# Altium schematic sheet 3 - Motor Drivers.SchDoc
size Tabloid
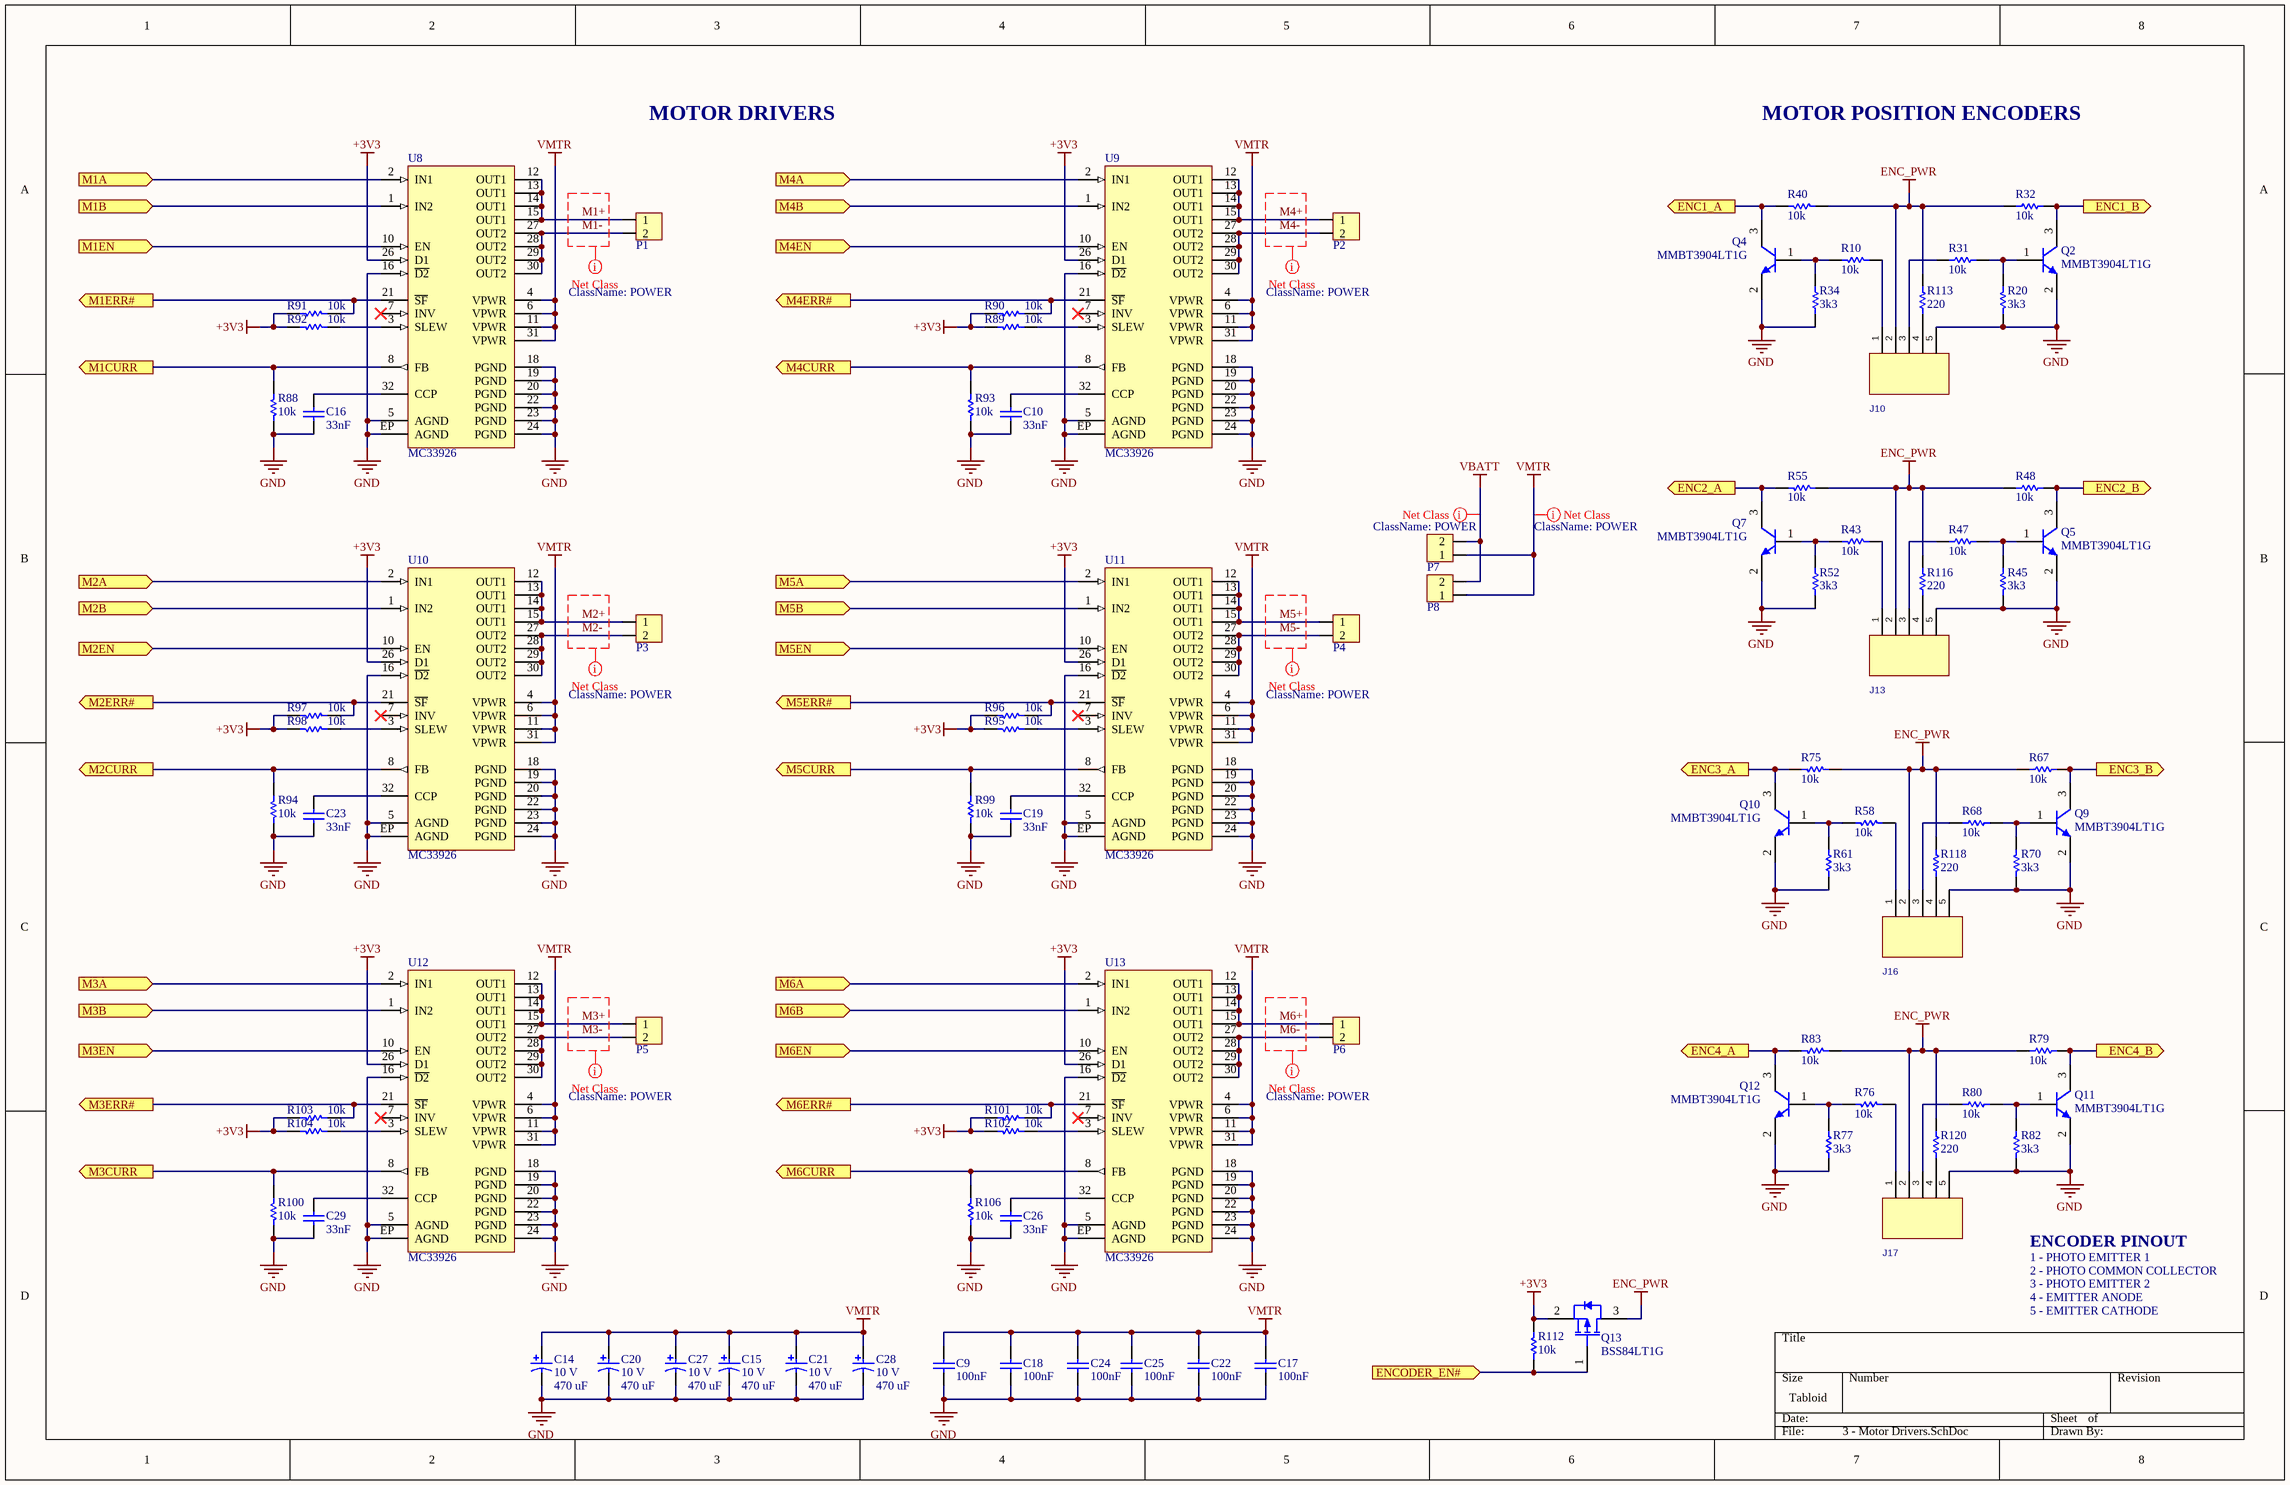
[diagram p0: 3 - Motor Drivers.SchDoc]

## Parts
C9  value 100nF  [CAPC0805(2012)100_L]  (hidden comment: CAP 100nF 6.3V 0805(2012))
C10  value 33nF  [CAPC0805(2012)100_L]  (hidden comment: CAP 33nF 50V 0805(2012))
C14  Rated Voltage: 10 V  Rated Capacitance: 470 uF  [NIC-CAPA2-8X10_V]  (hidden comment: UUD1A471MNL1GS)
C15  Rated Voltage: 10 V  Rated Capacitance: 470 uF  [NIC-CAPA2-8X10_V]  (hidden comment: UUD1A471MNL1GS)
C16  value 33nF  [CAPC0805(2012)100_L]  (hidden comment: CAP 33nF 50V 0805(2012))
C17  value 100nF  [CAPC0805(2012)100_L]  (hidden comment: CAP 100nF 6.3V 0805(2012))
C18  value 100nF  [CAPC0805(2012)100_L]  (hidden comment: CAP 100nF 6.3V 0805(2012))
C19  value 33nF  [CAPC0805(2012)100_L]  (hidden comment: CAP 33nF 50V 0805(2012))
C20  Rated Voltage: 10 V  Rated Capacitance: 470 uF  [NIC-CAPA2-8X10_V]  (hidden comment: UUD1A471MNL1GS)
C21  Rated Voltage: 10 V  Rated Capacitance: 470 uF  [NIC-CAPA2-8X10_V]  (hidden comment: UUD1A471MNL1GS)
C22  value 100nF  [CAPC0805(2012)100_L]  (hidden comment: CAP 100nF 6.3V 0805(2012))
C23  value 33nF  [CAPC0805(2012)100_L]  (hidden comment: CAP 33nF 50V 0805(2012))
C24  value 100nF  [CAPC0805(2012)100_L]  (hidden comment: CAP 100nF 6.3V 0805(2012))
C25  value 100nF  [CAPC0805(2012)100_L]  (hidden comment: CAP 100nF 6.3V 0805(2012))
C26  value 33nF  [CAPC0805(2012)100_L]  (hidden comment: CAP 33nF 50V 0805(2012))
C27  Rated Voltage: 10 V  Rated Capacitance: 470 uF  [NIC-CAPA2-8X10_V]  (hidden comment: UUD1A471MNL1GS)
C28  Rated Voltage: 10 V  Rated Capacitance: 470 uF  [NIC-CAPA2-8X10_V]  (hidden comment: UUD1A471MNL1GS)
C29  value 33nF  [CAPC0805(2012)100_L]  (hidden comment: CAP 33nF 50V 0805(2012))
J10  DF13-5P-1.25DS(20)  [HRS_DF13-5P-1.25DS(20)]  (value not drawn)
J13  DF13-5P-1.25DS(20)  [HRS_DF13-5P-1.25DS(20)]  (value not drawn)
J16  DF13-5P-1.25DS(20)  [HRS_DF13-5P-1.25DS(20)]  (value not drawn)
J17  DF13-5P-1.25DS(20)  [HRS_DF13-5P-1.25DS(20)]  (value not drawn)
P1  HDR1x2_2.54  [HDR1X2_2.54_180]  (value not drawn)
P2  HDR1x2_2.54  [HDR1X2_2.54_180]  (value not drawn)
P3  HDR1x2_2.54  [HDR1X2_2.54_180]  (value not drawn)
P4  HDR1x2_2.54  [HDR1X2_2.54_180]  (value not drawn)
P5  HDR1x2_2.54  [HDR1X2_2.54_180]  (value not drawn)
P6  HDR1x2_2.54  [HDR1X2_2.54_180]  (value not drawn)
P7  HDR1x2_2.54  [HDR1X2_2.54_180]  (value not drawn)
P8  HDR1x2_2.54  [HDR1X2_2.54_180]  (value not drawn)
Q2  MMBT3904LT1G  [ONSC-SOT-23-3-318-08_V]
Q4  MMBT3904LT1G  [ONSC-SOT-23-3-318-08_V]
Q5  MMBT3904LT1G  [ONSC-SOT-23-3-318-08_V]
Q7  MMBT3904LT1G  [ONSC-SOT-23-3-318-08_V]
Q9  MMBT3904LT1G  [ONSC-SOT-23-3-318-08_V]
Q10  MMBT3904LT1G  [ONSC-SOT-23-3-318-08_V]
Q11  MMBT3904LT1G  [ONSC-SOT-23-3-318-08_V]
Q12  MMBT3904LT1G  [ONSC-SOT-23-3-318-08_V]
Q13  BSS84LT1G  [ONSC-SOT-23-3-318-08_V]
R10  value 10k  [RESC0805(2012)_L]  (hidden comment: 10K 1% 0805(2012))
R20  value 3k3  [RESC0805(2012)_L]  (hidden comment: 3K3 1% 0805(2012))
R31  value 10k  [RESC0805(2012)_L]  (hidden comment: 10K 1% 0805(2012))
R32  value 10k  [RESC0805(2012)_L]  (hidden comment: 10K 1% 0805(2012))
R34  value 3k3  [RESC0805(2012)_L]  (hidden comment: 3K3 1% 0805(2012))
R40  value 10k  [RESC0805(2012)_L]  (hidden comment: 10K 1% 0805(2012))
R43  value 10k  [RESC0805(2012)_L]  (hidden comment: 10K 1% 0805(2012))
R45  value 3k3  [RESC0805(2012)_L]  (hidden comment: 3K3 1% 0805(2012))
R47  value 10k  [RESC0805(2012)_L]  (hidden comment: 10K 1% 0805(2012))
R48  value 10k  [RESC0805(2012)_L]  (hidden comment: 10K 1% 0805(2012))
R52  value 3k3  [RESC0805(2012)_L]  (hidden comment: 3K3 1% 0805(2012))
R55  value 10k  [RESC0805(2012)_L]  (hidden comment: 10K 1% 0805(2012))
R58  value 10k  [RESC0805(2012)_L]  (hidden comment: 10K 1% 0805(2012))
R61  value 3k3  [RESC0805(2012)_L]  (hidden comment: 3K3 1% 0805(2012))
R67  value 10k  [RESC0805(2012)_L]  (hidden comment: 10K 1% 0805(2012))
R68  value 10k  [RESC0805(2012)_L]  (hidden comment: 10K 1% 0805(2012))
R70  value 3k3  [RESC0805(2012)_L]  (hidden comment: 3K3 1% 0805(2012))
R75  value 10k  [RESC0805(2012)_L]  (hidden comment: 10K 1% 0805(2012))
R76  value 10k  [RESC0805(2012)_L]  (hidden comment: 10K 1% 0805(2012))
R77  value 3k3  [RESC0805(2012)_L]  (hidden comment: 3K3 1% 0805(2012))
R79  value 10k  [RESC0805(2012)_L]  (hidden comment: 10K 1% 0805(2012))
R80  value 10k  [RESC0805(2012)_L]  (hidden comment: 10K 1% 0805(2012))
R82  value 3k3  [RESC0805(2012)_L]  (hidden comment: 3K3 1% 0805(2012))
R83  value 10k  [RESC0805(2012)_L]  (hidden comment: 10K 1% 0805(2012))
R88  value 10k  [RESC0805(2012)_L]  (hidden comment: 10K 1% 0805(2012))
R89  value 10k  [RESC0805(2012)_L]  (hidden comment: 10K 1% 0805(2012))
R90  value 10k  [RESC0805(2012)_L]  (hidden comment: 10K 1% 0805(2012))
R91  value 10k  [RESC0805(2012)_L]  (hidden comment: 10K 1% 0805(2012))
R92  value 10k  [RESC0805(2012)_L]  (hidden comment: 10K 1% 0805(2012))
R93  value 10k  [RESC0805(2012)_L]  (hidden comment: 10K 1% 0805(2012))
R94  value 10k  [RESC0805(2012)_L]  (hidden comment: 10K 1% 0805(2012))
R95  value 10k  [RESC0805(2012)_L]  (hidden comment: 10K 1% 0805(2012))
R96  value 10k  [RESC0805(2012)_L]  (hidden comment: 10K 1% 0805(2012))
R97  value 10k  [RESC0805(2012)_L]  (hidden comment: 10K 1% 0805(2012))
R98  value 10k  [RESC0805(2012)_L]  (hidden comment: 10K 1% 0805(2012))
R99  value 10k  [RESC0805(2012)_L]  (hidden comment: 10K 1% 0805(2012))
R100  value 10k  [RESC0805(2012)_L]  (hidden comment: 10K 1% 0805(2012))
R101  value 10k  [RESC0805(2012)_L]  (hidden comment: 10K 1% 0805(2012))
R102  value 10k  [RESC0805(2012)_L]  (hidden comment: 10K 1% 0805(2012))
R103  value 10k  [RESC0805(2012)_L]  (hidden comment: 10K 1% 0805(2012))
R104  value 10k  [RESC0805(2012)_L]  (hidden comment: 10K 1% 0805(2012))
R106  value 10k  [RESC0805(2012)_L]  (hidden comment: 10K 1% 0805(2012))
R112  value 10k  [RESC0805(2012)_L]  (hidden comment: 10K 1% 0805(2012))
R113  value 220  [RESC0805(2012)_L]  (hidden comment: 220R 1% 0805(2012))
R116  value 220  [RESC0805(2012)_L]  (hidden comment: 220R 1% 0805(2012))
R118  value 220  [RESC0805(2012)_L]  (hidden comment: 220R 1% 0805(2012))
R120  value 220  [RESC0805(2012)_L]  (hidden comment: 220R 1% 0805(2012))
U8  MC33926  [FREESCALE_32PQFN]
U9  MC33926  [FREESCALE_32PQFN]
U10  MC33926  [FREESCALE_32PQFN]
U11  MC33926  [FREESCALE_32PQFN]
U12  MC33926  [FREESCALE_32PQFN]
U13  MC33926  [FREESCALE_32PQFN]

## Ports
ENC1_A (out), ENC1_B (out), ENC2_A (out), ENC2_B (out), ENC3_A (out), ENC3_B (out), ENC4_A (out), ENC4_B (out), ENCODER_EN# (in), M1A (in), M1B (in), M1CURR (out), M1EN (in), M1ERR# (out), M2A (in), M2B (in), M2CURR (out), M2EN (in), M2ERR# (out), M3A (in), M3B (in), M3CURR (out), M3EN (in), M3ERR# (out), M4A (in), M4B (in), M4CURR (out), M4EN (in), M4ERR# (out), M5A (in), M5B (in), M5CURR (out), M5EN (in), M5ERR# (out), M6A (in), M6B (in), M6CURR (out), M6EN (in), M6ERR# (out)

## Nets
+3V3: Q13.2(S) R89.2 R90.2 R91.2 R92.2 R95.2 R96.2 R97.2 R98.2 R101.2 R102.2 R103.2 R104.2 R112.1 U8.26(D1) U9.26(D1) U10.26(D1) U11.26(D1) U12.26(D1) U13.26(D1)
ENC_PWR: J10.2 J13.2 J16.2 J17.2 Q13.3(D) R32.1 R40.2 R48.1 R55.2 R67.1 R75.2 R79.1 R83.2 R113.2 R116.2 R118.2 R120.2
GND: C9.1 C10.1 C14.2 C15.2 C16.1 C17.1 C18.1 C19.1 C20.2 C21.2 C22.1 C23.1 C24.1 C25.1 C26.1 C27.2 C28.2 C29.1 J10.5 J13.5 J16.5 J17.5 Q2.2(E) Q4.2(E) Q5.2(E) Q7.2(E) Q9.2(E) Q10.2(E) Q11.2(E) Q12.2(E) R20.2 R34.2 R45.2 R52.2 R61.2 R70.2 R77.2 R82.2 R88.1 R93.1 R94.1 R99.1 R100.1 R106.1 U8.5(AGND) U8.16(~{D2}) U8.18(PGND) U8.19(PGND) U8.20(PGND) U8.22(PGND) U8.23(PGND) U8.24(PGND) U8.EP(AGND) U9.5(AGND) U9.16(~{D2}) U9.18(PGND) U9.19(PGND) U9.20(PGND) U9.22(PGND) U9.23(PGND) U9.24(PGND) U9.EP(AGND) U10.5(AGND) U10.16(~{D2}) U10.18(PGND) U10.19(PGND) U10.20(PGND) U10.22(PGND) U10.23(PGND) U10.24(PGND) U10.EP(AGND) U11.5(AGND) U11.16(~{D2}) U11.18(PGND) U11.19(PGND) U11.20(PGND) U11.22(PGND) U11.23(PGND) U11.24(PGND) U11.EP(AGND) U12.5(AGND) U12.16(~{D2}) U12.18(PGND) U12.19(PGND) U12.20(PGND) U12.22(PGND) U12.23(PGND) U12.24(PGND) U12.EP(AGND) U13.5(AGND) U13.16(~{D2}) U13.18(PGND) U13.19(PGND) U13.20(PGND) U13.22(PGND) U13.23(PGND) U13.24(PGND) U13.EP(AGND)
VBATT: P7.2 P8.2
VMTR: C9.2 C14.1 C15.1 C17.2 C18.2 C20.1 C21.1 C22.2 C24.2 C25.2 C27.1 C28.1 P7.1 P8.1 U8.4(VPWR) U8.6(VPWR) U8.11(VPWR) U8.31(VPWR) U9.4(VPWR) U9.6(VPWR) U9.11(VPWR) U9.31(VPWR) U10.4(VPWR) U10.6(VPWR) U10.11(VPWR) U10.31(VPWR) U11.4(VPWR) U11.6(VPWR) U11.11(VPWR) U11.31(VPWR) U12.4(VPWR) U12.6(VPWR) U12.11(VPWR) U12.31(VPWR) U13.4(VPWR) U13.6(VPWR) U13.11(VPWR) U13.31(VPWR)
ENC1_A: Q4.3(C) R40.1 ; port ENC1_A
ENC1_B: Q2.3(C) R32.2 ; port ENC1_B
ENC2_A: Q7.3(C) R55.1 ; port ENC2_A
ENC2_B: Q5.3(C) R48.2 ; port ENC2_B
ENC3_A: Q10.3(C) R75.1 ; port ENC3_A
ENC3_B: Q9.3(C) R67.2 ; port ENC3_B
ENC4_A: Q12.3(C) R83.1 ; port ENC4_A
ENC4_B: Q11.3(C) R79.2 ; port ENC4_B
ENCODER_EN#: Q13.1(G) R112.2 ; port ENCODER_EN#
M1+: P1.1 U8.12(OUT1) U8.13(OUT1) U8.14(OUT1) U8.15(OUT1)
M1-: P1.2 U8.27(OUT2) U8.28(OUT2) U8.29(OUT2) U8.30(OUT2)
M1A: U8.2(IN1) ; port M1A
M1B: U8.1(IN2) ; port M1B
M1CURR: R88.2 U8.8(FB) ; port M1CURR
M1EN: U8.10(EN) ; port M1EN
M1ERR#: R91.1 U8.21(~{SF}) ; port M1ERR#
M2+: P3.1 U10.12(OUT1) U10.13(OUT1) U10.14(OUT1) U10.15(OUT1)
M2-: P3.2 U10.27(OUT2) U10.28(OUT2) U10.29(OUT2) U10.30(OUT2)
M2A: U10.2(IN1) ; port M2A
M2B: U10.1(IN2) ; port M2B
M2CURR: R94.2 U10.8(FB) ; port M2CURR
M2EN: U10.10(EN) ; port M2EN
M2ERR#: R97.1 U10.21(~{SF}) ; port M2ERR#
M3+: P5.1 U12.12(OUT1) U12.13(OUT1) U12.14(OUT1) U12.15(OUT1)
M3-: P5.2 U12.27(OUT2) U12.28(OUT2) U12.29(OUT2) U12.30(OUT2)
M3A: U12.2(IN1) ; port M3A
M3B: U12.1(IN2) ; port M3B
M3CURR: R100.2 U12.8(FB) ; port M3CURR
M3EN: U12.10(EN) ; port M3EN
M3ERR#: R103.1 U12.21(~{SF}) ; port M3ERR#
M4+: P2.1 U9.12(OUT1) U9.13(OUT1) U9.14(OUT1) U9.15(OUT1)
M4-: P2.2 U9.27(OUT2) U9.28(OUT2) U9.29(OUT2) U9.30(OUT2)
M4A: U9.2(IN1) ; port M4A
M4B: U9.1(IN2) ; port M4B
M4CURR: R93.2 U9.8(FB) ; port M4CURR
M4EN: U9.10(EN) ; port M4EN
M4ERR#: R90.1 U9.21(~{SF}) ; port M4ERR#
M5+: P4.1 U11.12(OUT1) U11.13(OUT1) U11.14(OUT1) U11.15(OUT1)
M5-: P4.2 U11.27(OUT2) U11.28(OUT2) U11.29(OUT2) U11.30(OUT2)
M5A: U11.2(IN1) ; port M5A
M5B: U11.1(IN2) ; port M5B
M5CURR: R99.2 U11.8(FB) ; port M5CURR
M5EN: U11.10(EN) ; port M5EN
M5ERR#: R96.1 U11.21(~{SF}) ; port M5ERR#
M6+: P6.1 U13.12(OUT1) U13.13(OUT1) U13.14(OUT1) U13.15(OUT1)
M6-: P6.2 U13.27(OUT2) U13.28(OUT2) U13.29(OUT2) U13.30(OUT2)
M6A: U13.2(IN1) ; port M6A
M6B: U13.1(IN2) ; port M6B
M6CURR: R106.2 U13.8(FB) ; port M6CURR
M6EN: U13.10(EN) ; port M6EN
M6ERR#: R101.1 U13.21(~{SF}) ; port M6ERR#
NetC10_2: C10.2 U9.32(CCP)
NetC16_2: C16.2 U8.32(CCP)
NetC19_2: C19.2 U11.32(CCP)
NetC23_2: C23.2 U10.32(CCP)
NetC26_2: C26.2 U13.32(CCP)
NetC29_2: C29.2 U12.32(CCP)
NetJ10_1: J10.1 R10.1
NetJ10_3: J10.3 R31.1
NetJ10_4: J10.4 R113.1
NetJ13_1: J13.1 R43.1
NetJ13_3: J13.3 R47.1
NetJ13_4: J13.4 R116.1
NetJ16_1: J16.1 R58.1
NetJ16_3: J16.3 R68.1
NetJ16_4: J16.4 R118.1
NetJ17_1: J17.1 R76.1
NetJ17_3: J17.3 R80.1
NetJ17_4: J17.4 R120.1
NetQ2_1: Q2.1(B) R20.1 R31.2
NetQ4_1: Q4.1(B) R10.2 R34.1
NetQ5_1: Q5.1(B) R45.1 R47.2
NetQ7_1: Q7.1(B) R43.2 R52.1
NetQ9_1: Q9.1(B) R68.2 R70.1
NetQ10_1: Q10.1(B) R58.2 R61.1
NetQ11_1: Q11.1(B) R80.2 R82.1
NetQ12_1: Q12.1(B) R76.2 R77.1
NetR89_1: R89.1 U9.3(SLEW)
NetR92_1: R92.1 U8.3(SLEW)
NetR95_1: R95.1 U11.3(SLEW)
NetR98_1: R98.1 U10.3(SLEW)
NetR102_1: R102.1 U13.3(SLEW)
NetR104_1: R104.1 U12.3(SLEW)

Not connected (* = marked no-connect by the designer): U8 7(INV)*; U9 7(INV)*; U10 7(INV)*; U11 7(INV)*; U12 7(INV)*; U13 7(INV)*

## Layout directives
net class POWER: M1+, M1-, M2+, M2-, M3+, M3-, M4+, M4-, M5+, M5-, M6+, M6-, VBATT, VMTR

## Notes on the sheet
- MOTOR DRIVERS
- MOTOR POSITION ENCODERS
- ENCODER PINOUT
- 1 - PHOTO EMITTER 1
- 2 - PHOTO COMMON COLLECTOR
- 3 - PHOTO EMITTER 2
- 4 - EMITTER ANODE
- 5 - EMITTER CATHODE

## Library data of the parts
C9 C17 C18 C22 C24 C25 = CMP-1036-04391-1: CAP 100nF 6.3V Â±10% 0805 (2012 Metric) Thickness 1mm SMD; Case-EIA: 0805; Case-Metric: 2012; Rated Voltage: 6.3 V; Technology: SMT; Tolerance: Â±10%; Max Thickness: 1 mm
C10 C16 C19 C23 C26 C29 = CMP-1036-04174-1: CAP 33nF 50V -20% to +80% 0805 (2012 Metric) Thickness 1mm SMD; Case-Metric: 2012; Case-EIA: 0805; Tolerance: -20% to +80%; Technology: SMT; Max Thickness: 1 mm; Rated Voltage: 50 V
C14 C15 C20 C21 C27 C28 = CMP-0687-00070-1: Aluminum Electrolytic Capacitor, UD Series, Low Impedance, 470 uF, 10 V, + / - 20%, -55 to 105 degC, Chip Type, 8 x 10 mm D x L, Pb-Free, Reel; Manufacturer: Nichicon; Endurance Time: 5000 h; Tolerance Rated Capacitance: -20 to 20%; Packing: Dia382mm Reel; Rated Ripple Current (at 100kHz): 450 mA; Impedance: 0.17 Ohm; ComponentLink1Description: Manufacturer URL; DatasheetVersion: 08/2012; ComponentLink1URL: http://www.nichicon.co.jp/; Mounting Technology: Surface Mount; ComponentLink2URL: http://products.nichicon.co.jp/en/pdf/XJA043/e-ud.pdf; Length: 10 mm; PackageDescription: 2-Pin Surface Mount Device, Diameter 8 mm, Height 10 mm, Pitch 6.5 mm; RoHS: TRUE; PartNumber: UUD1A471MNL1GS; Diameter: 8 mm; ComponentLink3URL: http://products.nichicon.co.jp/en/pdf/XJA043/e-ud.pdf; ComponentLink3Description: Package Specification; ComponentLink2Description: Datasheet; PackageReference: CAPAE-D8H10
J10 J13 J16 J17 = CON_HRS_DF13-5P-1.25DS(20): CONN HEADER 5POS 1.25MM R/A THT TIN; Manufacturer: Hirose Electric Co Ltd; Connector Type: Header, Shrouded; Number of Positions: 5; Number of Positions Loaded: All; Pitch: 0.049" (1.25mm); Supplier 1: Digi-Key; Manufacturer Part Number: DF13-5P-1.25DS(20); RoHS: RoHS Compliant; Category: Connectors, Interconnects; Stock 1: 10851; Pricing 1: 1=0.61, 10=0.57, 50=0.456, 100=0.437, 250=0.399, 500=0.38, 1000=0.3135, 2500=0.285, 5000=0.2755 (USD); Packaging: Tube; Contact Type: Male Pin; Number of Rows: 1; Row Spacing: -; Contact Mating Length: -; Mounting Type: Through Hole, Right Angle; Termination: Solder; Fastening Type: -; Features: Board Guide; Contact Finish: Tin; Contact Finish Thickness: -; Color: Beige; ComponentLink1URL: http://www.hirose.co.jp/cataloge_hp/2d/EDC3-081818-01.pdf; ComponentLink1Description: http://www.hirose.co.jp/cataloge_hp/2d/EDC3-081818-01.pdf; Supplier Part Number 1: H2202-ND
P1-P8 = HDR1x2_2.54: Header
Q2 Q4 Q5 Q7 Q9-Q12 = CMP-1048-00631-1: General Purpose Transistor, NPN Silicon, 3-Pin SOT-23, Pb-Free, Tape and Reel; Manufacturer: On Semiconductor; IC Continuous (A): 0.2; fT Min (MHz): 300; ComponentLink2Description: Datasheet; Polarity: NPN; PackageDescription: 3-Pin Small Outline Transistor, Body 2.92 x 1.3 mm, Pitch 0.95 mm; ComponentLink2URL: http://www.onsemi.cn/pub_link/Collateral/MMBT3904LT1-D.PDF; DatasheetVersion: Rev. 12; Mounting Technology: Surface Mount; PartNumber: MMBT3904LT1G; ComponentLink1URL: http://www.onsemi.com/; ComponentLink3Description: Package Specification; ComponentLink1Description: Manufacturer URL; PackageVersion: Rev. AP, 11/2009; PackageReference: SOT-23-3-318-08; Packing: Tape and Reel; ComponentLink3URL: http://www.onsemi.cn/pub_link/Collateral/318-08.PDF; RoHS: TRUE
Q13 = CMP-1058-00762-1: Power MOSFET Single P-Channel, -50 V, 10 Ohm, 3-Pin SOT-23, Pb-Free, Tape and Reel; Manufacturer: On Semiconductor; Ciss Typ (pF): 36; ID Max (A): 0.13; Channel Polarity: P Channel; VGS(th) Max (V): 2; VGS Max (V): 20; V(BR)DSS Min (V): 50; Crss Typ (pF): 6.5; PD Max (W): 0.225; Coss Typ (pF): 17; Configuration: Single; Mounting Technology: Surface Mount; ComponentLink3URL: http://www.onsemi.cn/pub_link/Collateral/318-08.PDF; ComponentLink1Description: Manufacturer URL; Package Type: SOT-23-3; ComponentLink2URL: http://www.onsemi.com/pub_link/Collateral/BSS84LT1-D.PDF; RoHS: Pb-Free; Packing: Tape and Reel; ComponentLink1URL: http://www.onsemi.com/; PackageVersion: Rev. AP, 11/2009; PackageReference: SOT-23-3-318-08; PackageDescription: 3-Pin Small Outline Transistor, Body 2.92 x 1.3 mm, Pitch 0.95 mm; DatasheetVersion: Rev. 8; ComponentLink3Description: Package Specification; PartNumber: BSS84LT1G; ComponentLink2Description: Datasheet
R10 R31 R32 R40 R43 R47 R48 R55 R58 R67 R68 R75 R76 R79 R80 R83 R88-R104 R106 R112 = CMP-1013-00623-1: 10K 0.125W 1% 0805 (2012 Metric)  SMD; Case-Metric: 2012; Case-EIA: 0805; Tolerance: 1 %; Power: 0.125 W; Technology: SMT
R20 R34 R45 R52 R61 R70 R77 R82 = CMP-1013-00567-1: 3K3 0.125W 1% 0805 (2012 Metric)  SMD; Case-Metric: 2012; Case-EIA: 0805; Technology: SMT; Tolerance: 1 %; Power: 0.125 W
R113 R116 R118 R120 = CMP-1013-00433-1: 220R 0.125W 1% 0805 (2012 Metric)  SMD; Case-EIA: 0805; Case-Metric: 2012; Technology: SMT; Tolerance: 1 %; Power: 0.125 W
U8-U13 = MC33926: 5A Throttle Control H-Bridge